# Altium schematic sheet Wuhu_V1.SchDoc
size A4
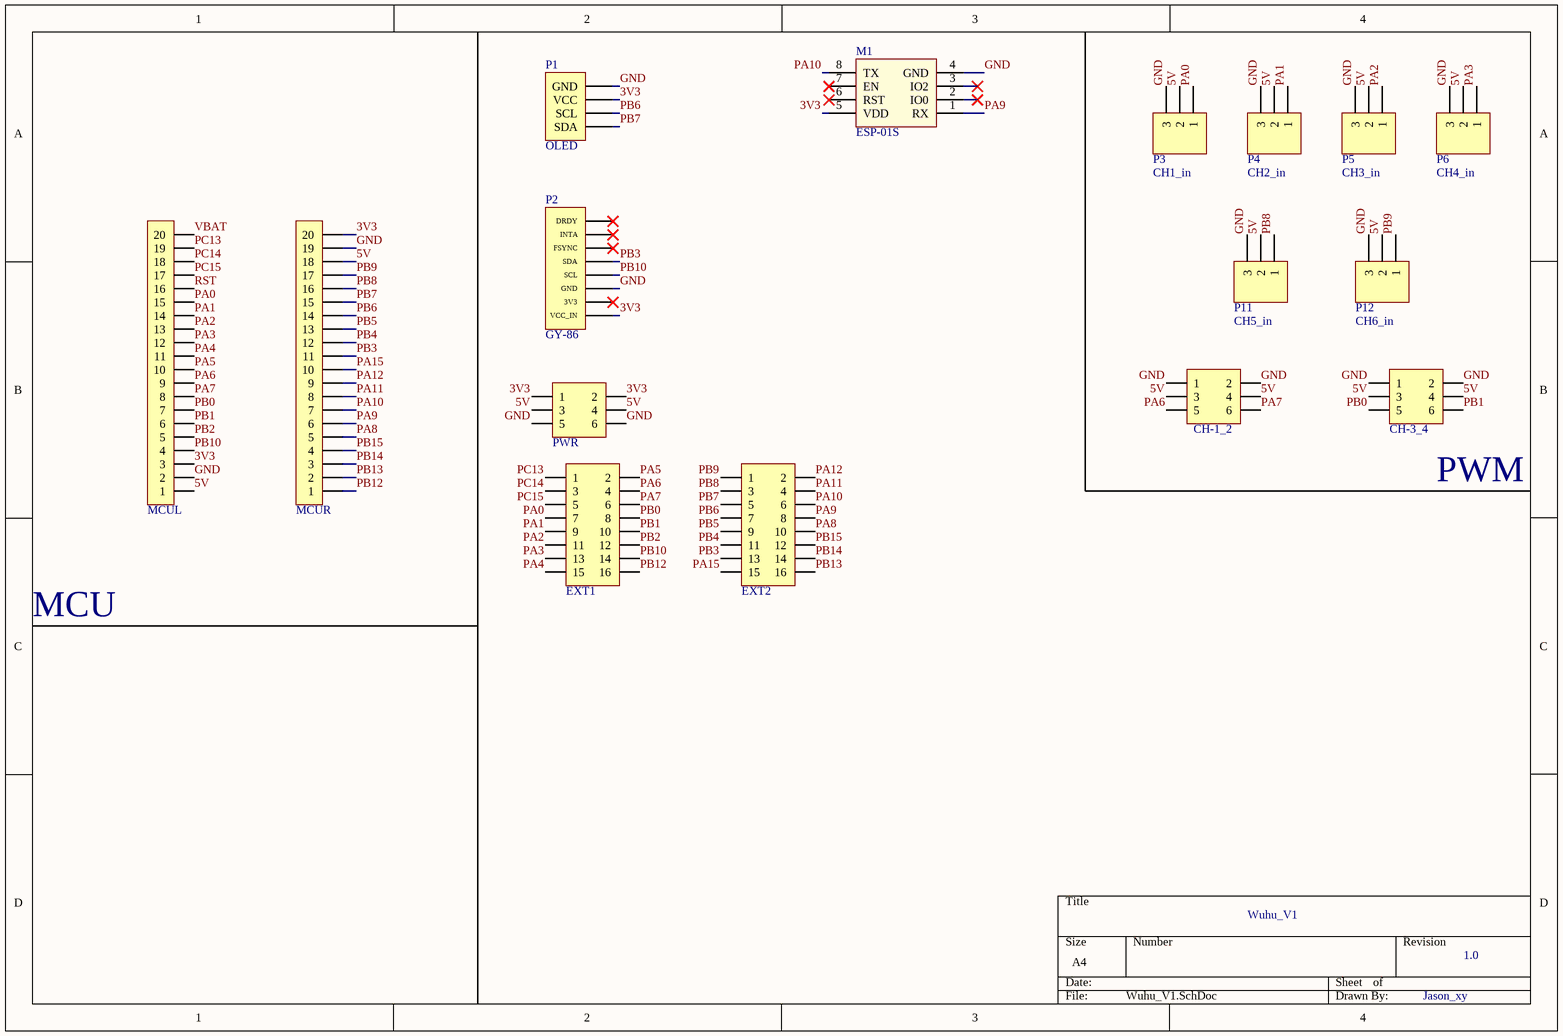
[diagram p0: Wuhu_V1.SchDoc]

## Parts
CH-1_2  Header3X2  [HDR2.54-WI-2x3P]  (value not drawn)
CH-3_4  Header3X2  [HDR2.54-WI-2x3P]  (value not drawn)
EXT1  Header 8X2  [HDR2.54-M-LS-2x8P]  (value not drawn)
EXT2  Header 8X2  [HDR2.54-M-LS-2x8P]  (value not drawn)
M1  ESP-01S  [ESP-01&01S Module]
MCUL  HDR-1X20  [HDR2.54-M-LI-20P]  (value not drawn)
MCUR  HDR-1X20  [HDR2.54-M-LI-20P]  (value not drawn)
P1  OLED  [HDR2.54-M-LI-4P]
P2  GY-86  [GY-86]
P3  CH1_in  [HDR2.54-WI-3P]
P4  CH2_in  [HDR2.54-WI-3P]
P5  CH3_in  [HDR2.54-WI-3P]
P6  CH4_in  [HDR2.54-WI-3P]
P11  CH5_in  [HDR2.54-WI-3P]
P12  CH6_in  [HDR2.54-WI-3P]
PWR  Header3X2  [HDR2.54-M-LS-2x3P]  (value not drawn)

## Nets
3V3: M1.5(VDD) MCUL.3 MCUR.20 P1.3(VCC) P2.1(VCC_IN) PWR.1 PWR.2
5V: CH-1_2.3 CH-1_2.4 CH-3_4.3 CH-3_4.4 MCUL.1 MCUR.18 P3.2 P4.2 P5.2 P6.2 P11.2 P12.2 PWR.3 PWR.4
GND: CH-1_2.1 CH-1_2.2 CH-3_4.1 CH-3_4.2 M1.4(GND) MCUL.2 MCUR.19 P1.4(GND) P2.3(GND) P3.3 P4.3 P5.3 P6.3 P11.3 P12.3 PWR.5 PWR.6
PA0: EXT1.7 MCUL.15 P3.1
PA1: EXT1.9 MCUL.14 P4.1
PA2: EXT1.11 MCUL.13 P5.1
PA3: EXT1.13 MCUL.12 P6.1
PA4: EXT1.15 MCUL.11
PA5: EXT1.2 MCUL.10
PA6: CH-1_2.5 EXT1.4 MCUL.9
PA7: CH-1_2.6 EXT1.6 MCUL.8
PA8: EXT2.10 MCUR.5
PA9: EXT2.8 M1.1(RX) MCUR.6
PA10: EXT2.6 M1.8(TX) MCUR.7
PA11: EXT2.4 MCUR.8
PA12: EXT2.2 MCUR.9
PA15: EXT2.15 MCUR.10
PB0: CH-3_4.5 EXT1.8 MCUL.7
PB1: CH-3_4.6 EXT1.10 MCUL.6
PB2: EXT1.12 MCUL.5
PB3: EXT2.13 MCUR.11 P2.5(SDA)
PB4: EXT2.11 MCUR.12
PB5: EXT2.9 MCUR.13
PB6: EXT2.7 MCUR.14 P1.2(SCL)
PB7: EXT2.5 MCUR.15 P1.1(SDA)
PB8: EXT2.3 MCUR.16 P11.1
PB9: EXT2.1 MCUR.17 P12.1
PB10: EXT1.14 MCUL.4 P2.4(SCL)
PB12: EXT1.16 MCUR.1
PB13: EXT2.16 MCUR.2
PB14: EXT2.14 MCUR.3
PB15: EXT2.12 MCUR.4
PC13: EXT1.1 MCUL.19
PC14: EXT1.3 MCUL.18
PC15: EXT1.5 MCUL.17
RST: MCUL.16
VBAT: MCUL.20

Not connected (* = marked no-connect by the designer): M1 2(IO0)* 3(IO2)* 6(RST)* 7(EN)*; P2 2(3V3)* 6(FSYNC)* 7(INTA)* 8(DRDY)*

## Notes on the sheet
- (near CH-3_4) PWM
- MCU
- Wuhu_V1
- 1.0
- Jason_xy

## Library data of the parts
CH-1_2 CH-3_4 PWR = Header 3X2: 3*2P接插件; 版权归属: 源创客; BOM名称: 3*2P接插件; 学习资源: www.ooocke.com
EXT1 EXT2 = Header 8X2: 8*2P接插件; 版权归属: 源创客; BOM名称: 8*2P接插件; 学习资源: www.ooocke.com
M1 = ESP-01&01S Module
MCUL MCUR = Header 20: 20P接插件; 版权归属: 源创客; BOM名称: 20P接插件; 学习资源: www.ooocke.com
P1 = MHDR1X4: Header, 4-Pin; LatestRevisionDate: 17-Jul-2002; LatestRevisionNote: Re-released for DXP Platform.; Publisher: Altium Limited
P2 = MHDR1X8: Header, 8-Pin; LatestRevisionDate: 17-Jul-2002; LatestRevisionNote: Re-released for DXP Platform.; Publisher: Altium Limited
P3-P6 P11 P12 = MHDR1X3: Header, 3-Pin; LatestRevisionDate: 17-Jul-2002; LatestRevisionNote: Re-released for DXP Platform.; Publisher: Altium Limited